# Altium schematic sheet SCH_MEGO_Node_V1.SchDoc
size A4
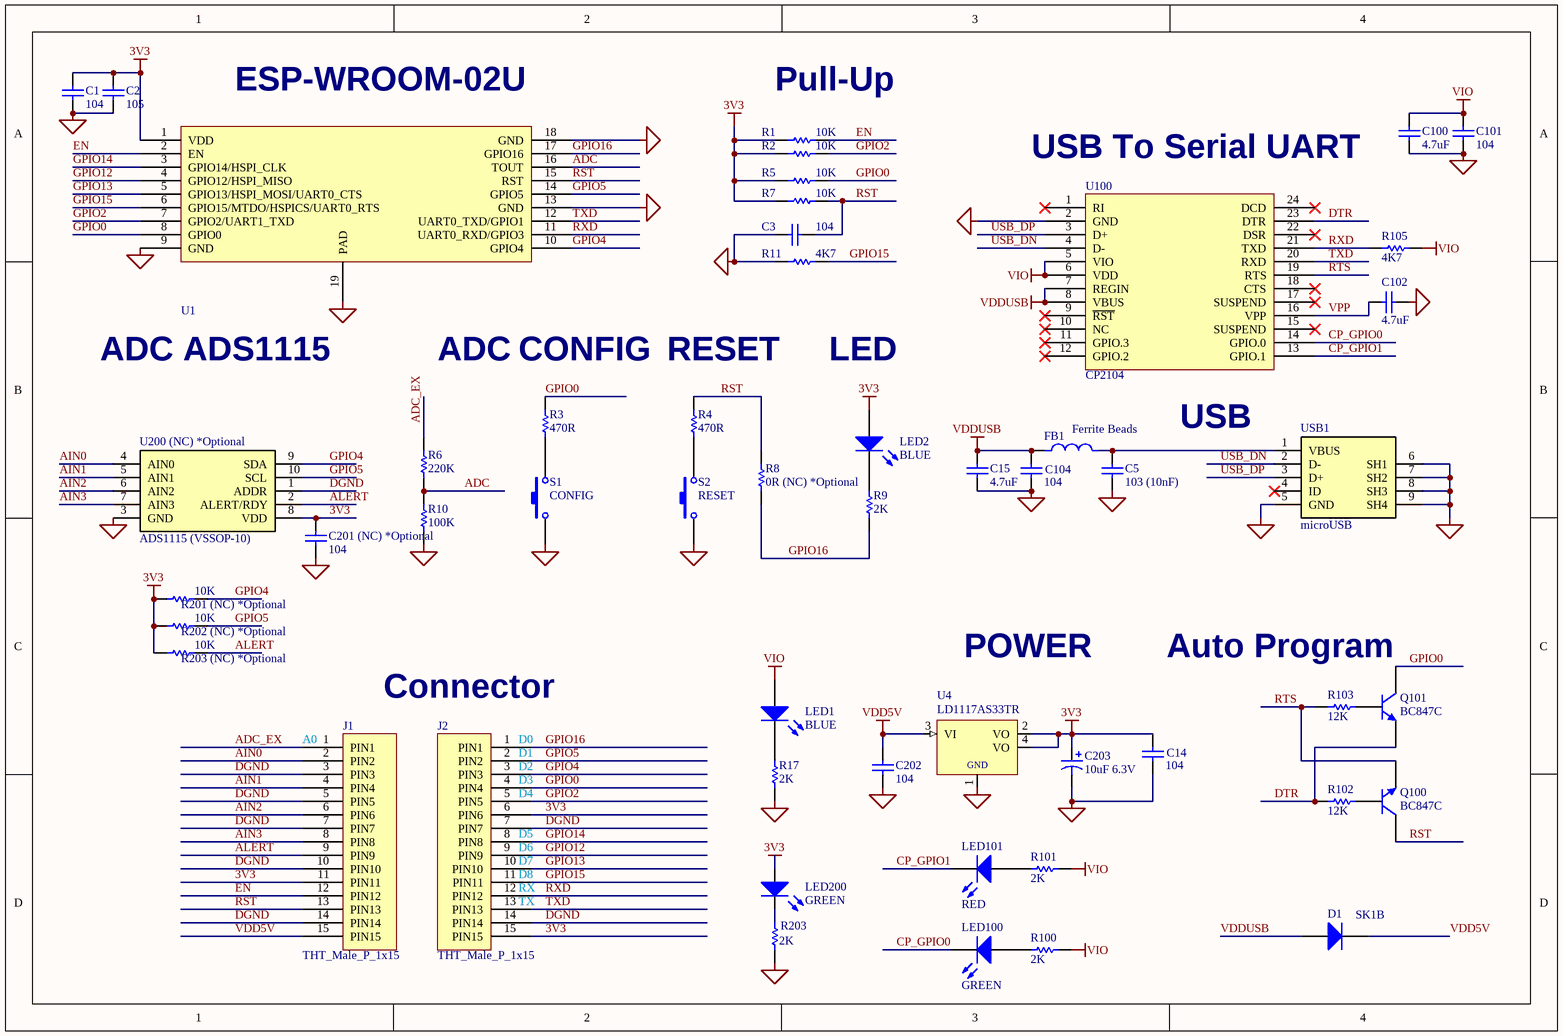
[diagram p0: SCH_MEGO_Node_V1.SchDoc]

## Parts
C1  104  [IPC7351_EC_0603]
C2  105  [IPC7351_EC_0603]
C3  104  [IPC7351_EC_0603]
C5  103 (10nF)  [IPC7351_EC_0603]
C14  104  [IPC7351_EC_0603]
C15  4.7uF  [IPC7351_EC_0603]
C100  4.7uF  [IPC7351_EC_0603]
C101  104  [IPC7351_EC_0603]
C102  4.7uF  [IPC7351_EC_0603]
C104  104  [IPC7351_EC_0603]
C201_(NC)_*Optional  104  [IPC7351_EC_0603]
C202  104  [IPC7351_EC_0603]
C203  10uF 6.3V  [3216_18]
D1  SK1B  [EDIS_SMA]
FB1  Ferrite Beads  [R0805]
J1  THT_Male_P_1x15  [HDR_1X15]
J2  THT_Male_P_1x15  [HDR_1X15]
LED1  BLUE  [IPC7351_ELDS_0603]
LED2  BLUE  [IPC7351_ELDS_0603]
LED100  GREEN  [IPC7351_ELDS_0603]
LED101  RED  [IPC7351_ELDS_0603]
LED200  GREEN  [IPC7351_ELDS_0603]
Q100  BC847C  [SOT-23-3]
Q101  BC847C  [SOT-23-3]
R1  10K  [IPC7351_ER_0603]
R2  10K  [IPC7351_ER_0603]
R3  470R  [IPC7351_ER_0603]
R4  470R  [IPC7351_ER_0603]
R5  10K  [IPC7351_ER_0603]
R6  220K  [IPC7351_ER_0603]
R7  10K  [IPC7351_ER_0603]
R8  0R (NC) *Optional  [IPC7351_ER_0603]
R9  2K  [IPC7351_ER_0603]
R10  100K  [IPC7351_ER_0603]
R11  4K7  [IPC7351_ER_0603]
R17  2K  [IPC7351_ER_0603]
R100  2K  [IPC7351_ER_0603]
R101  2K  [IPC7351_ER_0603]
R102  12K  [IPC7351_ER_0603]
R103  12K  [IPC7351_ER_0603]
R105  4K7  [IPC7351_ER_0603]
R201_(NC)_*Optional  10K  [IPC7351_ER_0603]
R202_(NC)_*Optional  10K  [IPC7351_ER_0603]
R203  2K  [IPC7351_ER_0603]
R203_(NC)_*Optional  10K  [IPC7351_ER_0603]
S1  CONFIG  [SKRKAEE010]
S2  RESET  [SKRKAEE010]
U1  ESP8266_WROOM_02U  [ESP-WROOM-02D]  (value not drawn)
U4  LD1117AS33TR  [SOT-223-1]
U100  CP2104  [QFN24]
U200_(NC)_*Optional  ADS1115 (VSSOP-10)  [DGS-S-PDSO-G10]
USB1  microUSB  [MICRO-USB-CON]

## Nets
3V3: C1.2 C2.2 C14.1 C201_(NC)_*Optional.2 C203.1 J1.11(PIN11) J2.6(PIN6) J2.15(PIN15) LED2.1(A) LED200.1(A) R1.2 R2.2 R5.2 R7.2 R201_(NC)_*Optional.2 R202_(NC)_*Optional.2 R203_(NC)_*Optional.2 U1.1(VDD) U4.2(VO) U4.4(VO) U200_(NC)_*Optional.8(VDD)
DGND: C1.1 C2.1 C3.1 C5.1 C14.2 C15.2 C100.2 C101.2 C102.2 C104.2 C201_(NC)_*Optional.1 C202.1 C203.2 J1.3(PIN3) J1.5(PIN5) J1.7(PIN7) J1.10(PIN10) J1.14(PIN14) J2.7(PIN7) J2.14(PIN14) R10.1 R11.2 R17.1 R203.1 S1.2 S2.1 U1.9(GND) U1.13(GND) U1.18(GND) U1.19(PAD) U4.1(GND) U100.2(GND) U200_(NC)_*Optional.1(ADDR) U200_(NC)_*Optional.3(GND) USB1.5(GND) USB1.6(SH1) USB1.7(SH2) USB1.8(SH3) USB1.9(SH4)
VDD5V: C202.2 D1.2(K) J1.15(PIN15) U4.3(VI)
VDDUSB: C15.1 C104.1 D1.1(A) FB1.1 U100.7(REGIN) U100.8(VBUS)
VIO: C100.1 C101.1 LED1.1(A) R100.2 R101.2 R105.2 U100.5(VIO) U100.6(VDD)
ADC: R6.2 R10.2 U1.16(TOUT)
ADC_EX: J1.1(PIN1) R6.1
AIN0: J1.2(PIN2) U200_(NC)_*Optional.4(AIN0)
AIN1: J1.4(PIN4) U200_(NC)_*Optional.5(AIN1)
AIN2: J1.6(PIN6) U200_(NC)_*Optional.6(AIN2)
AIN3: J1.8(PIN8) U200_(NC)_*Optional.7(AIN3)
ALERT: J1.9(PIN9) R203_(NC)_*Optional.1 U200_(NC)_*Optional.2(ALERT/RDY)
CP_GPIO0: LED100.2(K) U100.14(GPIO.0)
CP_GPIO1: LED101.2(K) U100.13(GPIO.1)
DTR: Q101.2(E) R102.2 U100.23(DTR)
EN: J1.12(PIN12) R1.1 U1.2(EN)
GPIO0: J2.4(PIN4) Q101.3(C) R3.1 R5.1 U1.8(GPIO0)
GPIO2: J2.5(PIN5) R2.1 U1.7(GPIO2/UART1_TXD)
GPIO4: J2.3(PIN3) R201_(NC)_*Optional.1 U1.10(GPIO4) U200_(NC)_*Optional.9(SDA)
GPIO5: J2.2(PIN2) R202_(NC)_*Optional.1 U1.14(GPIO5) U200_(NC)_*Optional.10(SCL)
GPIO12: J2.9(PIN9) U1.4(GPIO12/HSPI_MISO)
GPIO13: J2.10(PIN10) U1.5(GPIO13/HSPI_MOSI/UART0_CTS)
GPIO14: J2.8(PIN8) U1.3(GPIO14/HSPI_CLK)
GPIO15: J2.11(PIN11) R11.1 U1.6(GPIO15/MTDO/HSPICS/UART0_RTS)
GPIO16: J2.1(PIN1) R8.1 R9.1 U1.17(GPIO16)
RST: C3.2 J1.13(PIN13) Q100.3(C) R4.2 R7.1 R8.2 U1.15(RST)
RTS: Q100.2(E) R103.2 U100.19(RTS)
RXD: J2.12(PIN12) R105.1 U1.11(UART0_RXD/GPIO3) U100.21(TXD)
TXD: J2.13(PIN13) U1.12(UART0_TXD/GPIO1) U100.20(RXD)
USB_DN: U100.4(D-) USB1.2(D-)
USB_DP: U100.3(D+) USB1.3(D+)
VPP: C102.1 U100.16(VPP)
NetC5_2: C5.2 FB1.2 USB1.1(VBUS)
NetLED1_2: LED1.2(K) R17.2
NetLED2_2: LED2.2(K) R9.2
NetLED100_1: LED100.1(A) R100.1
NetLED101_1: LED101.1(A) R101.1
NetLED200_2: LED200.2(K) R203.2
NetQ100_1: Q100.1(B) R102.1
NetQ101_1: Q101.1(B) R103.1
NetR3_2: R3.2 S1.1
NetR4_1: R4.1 S2.2

Not connected (* = marked no-connect by the designer): U100 1(RI)* 9(~{RST})* 10(NC)* 11(GPIO.3)* 12(GPIO.2)* 15(SUSPEND)* 17(SUSPEND)* 18(CTS)* 22(DSR)* 24(DCD)*; USB1 4(ID)*

## Notes on the sheet
- (near U1) ESP-WROOM-02U
- Pull-Up
- (near U100) USB To Serial UART
- ADC ADS1115
- ADC
- (near R3) CONFIG
- (near R4) RESET
- LED
- (near U100) USB
- Connector
- POWER
- Auto Program
- (near J1) A0
- (near J2) D0
- (near J2) D1
- (near J2) D2
- (near J2) D3
- (near J2) D4
- (near J2) D5
- (near J2) D6
- (near J2) D7
- (near J2) D8
- (near J2) RX
- (near J2) TX

## Library data of the parts
C1 C3 C14 C101 C104 C201_(NC)_*Optional C202 = Cap Semi: 0.1µF ±5% 50V Ceramic Capacitor X7R 0603; MFG: KEMET; MFG P/N: C0603C104J5RACTU
C2 = Cap Semi: 1µF ±5% 50V Ceramic Capacitor X7R 0603; MFG: KEMET; MFG P/N: C0603C104J5RACTU
C5 = Cap Semi: 0.01µF ±5% 50V Ceramic Capacitor X7R 0603; MFG: KEMET; MFG P/N: C0603C104J5RACTU
C15 = Cap: 4.7µF ±10% 16V Ceramic Capacitor X5R 0805; MFG: KEMET; MFG P/N: C0603C475K8PACTU
C100 C102 = Cap: 4.7µF ±10% 16V Ceramic Capacitor X5R 0603; MFG: KEMET; MFG P/N: C0603C475K8PACTU
C203 = Cap Pol1: 10µF 6.3V Tantalum Chip Capacitors ±20%; MFG: ROHM; MFG P/N: TCA0J106M8R; Supplier1: ES; Supplier_Part_Number: 0176-0676-3; Supplier_Purchase_URL: https://www.es.co.th/detail.asp?Prod=017606763
D1 = Diode: SK1B SCHOTTKY BARRIER DIODE 100V/1A; Part: EDIS005; Vender: stock; Value: 6.05; Published: 8-Jun-2000; LatestRevisionDate: 17-Jul-2002; LatestRevisionNote: Re-released for DXP Platform.; PackageDocument: Sep-1996; PackageReference: SMC; Publisher: Altium Limited; Code_JEDEC: DO-214-AB; MFG P/N: SK1B; Supplier_Part_Number: 863-MBRA340T3G; Supplier1: ES; Supplier_Purchase_URL: https://www.es.co.th/detail.asp?Prod=035300128
FB1 = FB: Ferrite Beads Chip Beads 600Ω for Signal Line; MFG: TDK; MFG P/N: MMZ1608S601A; Supplier_Part_Number: 0169-0031-5; Supplier1: ES; Supplier_Purchase_URL: https://www.es.co.th/detail.asp?Prod=016900315
J1 J2 = THT_Male_P_1x15: THT Male pin header strip 1x15
LED1 LED2 LED101 = LED2: LED RED 0603; MFG P/N: LTST-C190KRKT; MFG: LITE-ON
LED100 = LED2: LED BLUE 0603; MFG P/N: LTST-C193TBKT-5A; MFG: LITE-ON
LED200 = LED2: LED BLUE 0603; MFG: LITE-ON; MFG P/N: LTST-C193TBKT-5A
Q100 Q101 = NPN: Bipolar (BJT) Transistor NPN 45V 100mA 100MHz 250mW Surface Mount TO-236AB (SOT23); MFG: PHILIPS/NXP; MFG P/N: BC847C,215; Supplier1: ES; Supplier_Part_Number: 0016-0250-0; Supplier_Purchase_URL: https://www.es.co.th/detail.asp?Prod=001602500
R1-R5 R7-R9 R11 R17 R100-R103 R105 R201_(NC)_*Optional R202_(NC)_*Optional R203 R203_(NC)_*Optional = Res Semi: Resistor 0603
  R1 R2 R7 R11 R105 R201_(NC)_*Optional R202_(NC)_*Optional R203_(NC)_*Optional: MFG P/N: *
  R5: Supplier1 Price: 0.4; MFG P/N: *
R6 = Res Semi: Resistor 0603 1%; MFG: VISHAY; MFG P/N: CRCW06033M24FKEA; Supplier1: Digikey; Supplier1 Price: 0.4
R10 = Res Semi: Resistor 0603 1%; MFG: ROHM; MFG P/N: MCR03ERTF1004; Supplier1: Digikey; Supplier1 Price: 0.4
S1 S2 = SW-PB: TACT SWITCH Size 6x6mm,2 Pins, SPST-NO; MFG: WEALTH METAL; MFG P/N: TC-0202-X(ROHS); Supplier1: ES; Supplier_Part_Number: 0171-0110-1; Supplier_Purchase_URL: https://www.es.co.th/detail.asp?Prod=017101101
U1 = ESP8266 WROOM 02: WiFi Serial Transceiver Module (ESP8266) 02U-2MB; MFG P/N: ESP-WROOM-02U-4MB; MFG: ESPRESSIF; Supplier1: QWAVE
U4 = LM1117MPX-3.3: LD1117AS33TR Positive Fixed Voltage Regulator LDO 3.3V/1A; MFG: ST MICROELECTRONICS; MFG P/N: LD1117AS33TR; Value: *; Supplier_Part_Number: 0083-0491-4; Supplier_Purchase_URL: https://www.es.co.th/detail.asp?prod=008304914; Supplier1: ES
U100 = CP2104: USB Bridge, USB to UART USB 2.0 UART Interface 24QFN; MFG P/N: CP2104-F03-GM; MFG: Silicon Labs; Supplier1: Mouser; Supplier_Purchase_URL: https://th.mouser.com/ProductDetail/634-CP2104-F03-GMR; Supplier_Part_Number: 634-CP2104-F03-GMR
U200_(NC)_*Optional = ADS1115: ADS1115 Analog to Digital Converters - ADC 16B ADC w/ Int MUX PGA Comp Osc & Ref; MFG P/N: ADS1115IDGSR; MFG: Texas Instruments; Supplier1: Mouser; Supplier1 P/N: 595-ADS1115IDGSR